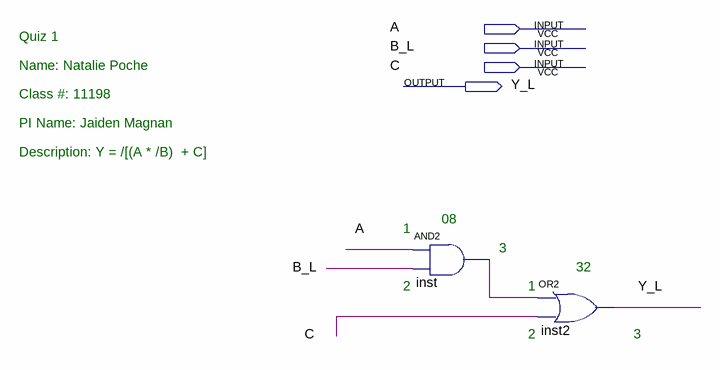
[diagram p0: schematic sheet]
// Quartus schematic quiz1.bdf as structural Verilog: 2 symbols, 4 pins
module quiz1 (
  input  A,
  input  B_L,
  input  C,
  output Y_L
);

  wire inst_out;

  and inst (inst_out, A, B_L);
  or inst2 (Y_L, inst_out, C);

  // Notes on the sheet:
  //   Quiz 1
  //   Name: Natalie Poche
  //   Class #: 11198
  //   PI Name: Jaiden Magnan
  //   Description: Y = /[(A * /B)  + C]
  //   08
  //   1
  //   3
  //   32
  //   2
  //   1
  //   2
  //   3
endmodule
